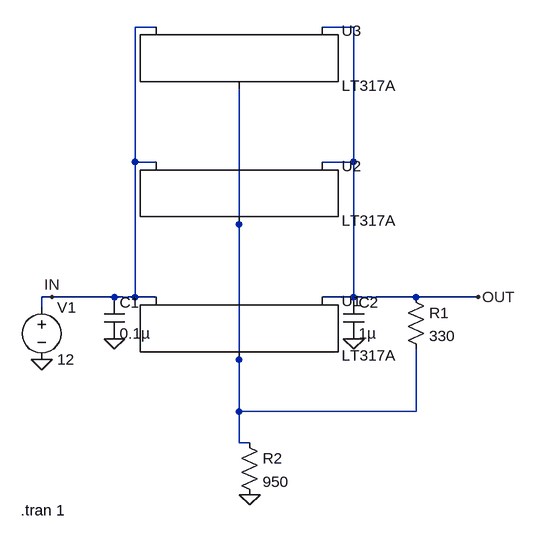
[diagram p0: schematic regulator.asc]
regulator.asc, the LTspice schematic file:
Version 4
SHEET 1 984 680
WIRE 64 -272 32 -272
WIRE 368 -272 320 -272
WIRE 32 -64 32 -272
WIRE 64 -64 32 -64
WIRE 368 -64 368 -272
WIRE 368 -64 320 -64
WIRE 192 32 192 -176
WIRE -96 144 -112 144
WIRE 0 144 -96 144
WIRE 32 144 32 -64
WIRE 32 144 0 144
WIRE 64 144 32 144
WIRE 368 144 368 -64
WIRE 368 144 320 144
WIRE 464 144 368 144
WIRE 560 144 464 144
WIRE -112 160 -112 144
WIRE 192 240 192 32
WIRE 192 320 192 240
WIRE 464 320 464 224
WIRE 464 320 192 320
WIRE 192 368 192 320
WIRE 208 368 192 368
FLAG -112 240 0
FLAG 208 448 0
FLAG 0 208 0
FLAG 368 208 0
FLAG 560 144 OUT
FLAG -96 144 IN
SYMBOL PowerProducts\\LT317A 192 144 R0
SYMATTR InstName U1
SYMBOL voltage -112 144 R0
WINDOW 123 0 0 Left 0
WINDOW 39 0 0 Left 0
SYMATTR InstName V1
SYMATTR Value 12
SYMBOL res 448 128 R0
SYMATTR InstName R1
SYMATTR Value 330
SYMBOL res 192 352 R0
SYMATTR InstName R2
SYMATTR Value 950
SYMBOL cap -16 144 R0
SYMATTR InstName C1
SYMATTR Value 0.1µ
SYMBOL cap 352 144 R0
SYMATTR InstName C2
SYMATTR Value 1µ
SYMBOL PowerProducts\\LT317A 192 -64 R0
SYMATTR InstName U2
SYMBOL PowerProducts\\LT317A 192 -272 R0
SYMATTR InstName U3
TEXT -144 472 Left 2 !.tran 1

The netlist it stands for:
* regulator.asc
XU1 N001 OUT IN LT317A
V1 IN 0 12
R1 OUT N001 330
R2 N001 0 950
C1 IN 0 0.1µ
C2 OUT 0 1µ
XU2 N001 OUT IN LT317A
XU3 N001 OUT IN LT317A
.tran 1
.lib LTC.lib
.backanno
.end